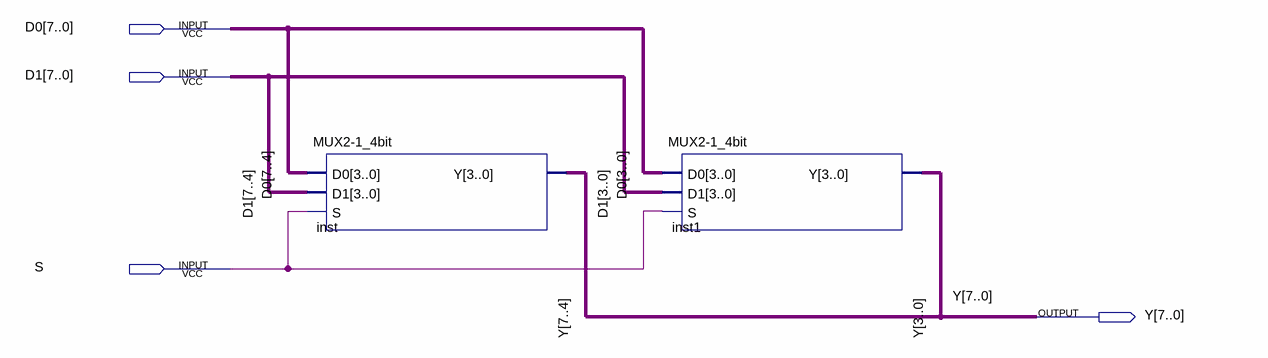
[diagram p0: schematic sheet]
// Quartus schematic mux2-1_8bit.bdf as structural Verilog: 2 symbols, 4 pins
module \mux2-1_8bit  (
  input  [7:0] D0,
  input  [7:0] D1,
  input  S,
  output [7:0] Y
);

  \MUX2-1_4bit  inst (.D0(D0[7:4]), .D1(D1[7:4]), .S(S), .Y(Y[7:4]));
  \MUX2-1_4bit  inst1 (.D0(D0[3:0]), .D1(D1[3:0]), .S(S), .Y(Y[3:0]));
endmodule
